# Altium schematic sheet PressureADC.SchDoc
size A4
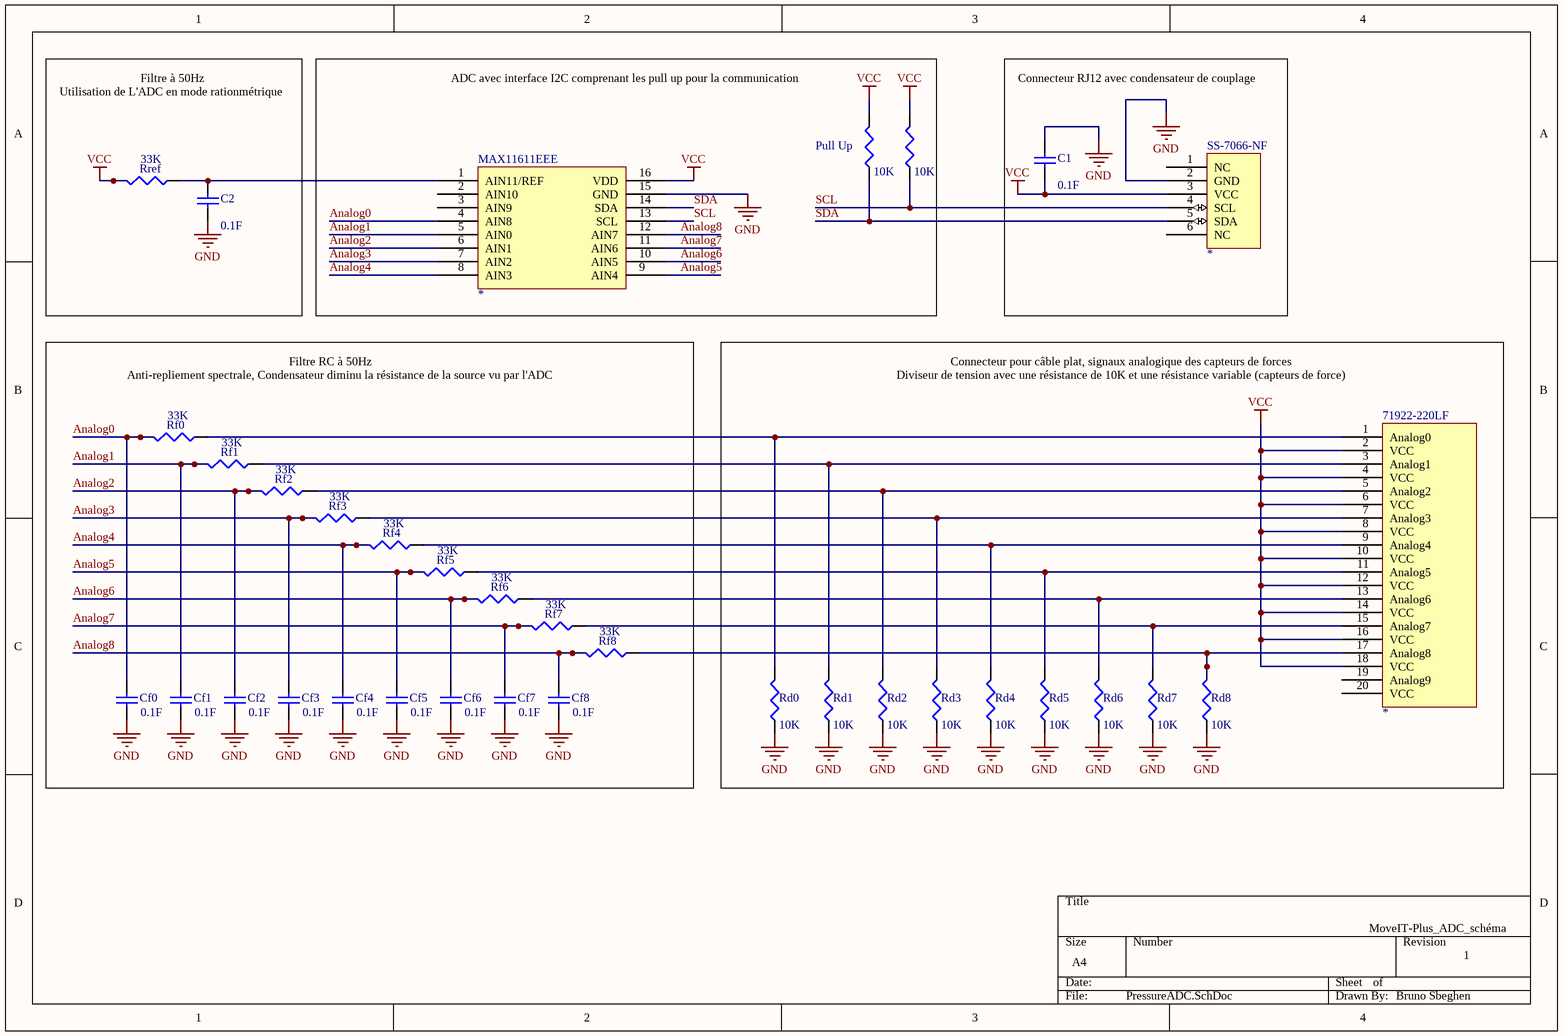
[diagram p0: PressureADC.SchDoc]

## Parts
71922-220LF  *  [71922-220LF]
?  value 10K  [6-0805_N]  (hidden comment: Res 10K)
C1  value 0.1F  [C0805]  (hidden comment: Cap 0.1uF)
C2  value 0.1F  [C0805]  (hidden comment: Cap 0.1uF)
Cf0  value 0.1F  [C0805]  (hidden comment: Cap 0.1uF)
Cf1  value 0.1F  [C0805]  (hidden comment: Cap 0.1uF)
Cf2  value 0.1F  [C0805]  (hidden comment: Cap 0.1uF)
Cf3  value 0.1F  [C0805]  (hidden comment: Cap 0.1uF)
Cf4  value 0.1F  [C0805]  (hidden comment: Cap 0.1uF)
Cf5  value 0.1F  [C0805]  (hidden comment: Cap 0.1uF)
Cf6  value 0.1F  [C0805]  (hidden comment: Cap 0.1uF)
Cf7  value 0.1F  [C0805]  (hidden comment: Cap 0.1uF)
Cf8  value 0.1F  [C0805]  (hidden comment: Cap 0.1uF)
MAX11611EEE  *  [MAX11611EEE+]
Pull_Up  value 10K  [6-0805_N]  (hidden comment: Res 10K)
Rd0  value 10K  [6-0805_N]  (hidden comment: Res 10K)
Rd1  value 10K  [6-0805_N]  (hidden comment: Res 10K)
Rd2  value 10K  [6-0805_N]  (hidden comment: Res 10K)
Rd3  value 10K  [6-0805_N]  (hidden comment: Res 10K)
Rd4  value 10K  [6-0805_N]  (hidden comment: Res 10K)
Rd5  value 10K  [6-0805_N]  (hidden comment: Res 10K)
Rd6  value 10K  [6-0805_N]  (hidden comment: Res 10K)
Rd7  value 10K  [6-0805_N]  (hidden comment: Res 10K)
Rd8  value 10K  [6-0805_N]  (hidden comment: Res 10K)
Rf0  value 33K  [6-0805_N]  (hidden comment: Res 33K)
Rf1  value 33K  [6-0805_N]  (hidden comment: Res 33K)
Rf2  value 33K  [6-0805_N]  (hidden comment: Res 33K)
Rf3  value 33K  [6-0805_N]  (hidden comment: Res 33K)
Rf4  value 33K  [6-0805_N]  (hidden comment: Res 33K)
Rf5  value 33K  [6-0805_N]  (hidden comment: Res 33K)
Rf6  value 33K  [6-0805_N]  (hidden comment: Res 33K)
Rf7  value 33K  [6-0805_N]  (hidden comment: Res 33K)
Rf8  value 33K  [6-0805_N]  (hidden comment: Res 33K)
Rref  value 33K  [6-0805_N]  (hidden comment: Res 33K)
SS-7066-NF  *  [SS-7066-NF]

## Blocks framed on the sheet
Connecteur RJ12 avec condensateur de couplage: C1 SS-7066-NF
Filtre RC à 50Hz: Cf0-Cf8 Rf0-Rf8

## Nets
GND: C1.2 C2.1 Cf0.2 Cf1.2 Cf2.2 Cf3.2 Cf4.2 Cf5.2 Cf6.2 Cf7.2 Cf8.2 MAX11611EEE.15(GND) Rd0.1 Rd1.1 Rd2.1 Rd3.1 Rd4.1 Rd5.1 Rd6.1 Rd7.1 Rd8.1 SS-7066-NF.2(GND)
VCC: 71922-220LF.2(VCC) 71922-220LF.4(VCC) 71922-220LF.6(VCC) 71922-220LF.8(VCC) 71922-220LF.10(VCC) 71922-220LF.12(VCC) 71922-220LF.14(VCC) 71922-220LF.16(VCC) 71922-220LF.18(VCC) ?.2 C1.1 MAX11611EEE.16(VDD) Pull_Up.2 Rref.2 SS-7066-NF.3(VCC)
Analog0: Cf0.1 MAX11611EEE.4(AIN8) Rf0.2
Analog1: Cf1.1 MAX11611EEE.5(AIN0) Rf1.2
Analog2: Cf2.1 MAX11611EEE.6(AIN1) Rf2.2
Analog3: Cf3.1 MAX11611EEE.7(AIN2) Rf3.2
Analog4: Cf4.1 MAX11611EEE.8(AIN3) Rf4.2
Analog5: Cf5.1 MAX11611EEE.9(AIN4) Rf5.2
Analog6: Cf6.1 MAX11611EEE.10(AIN5) Rf6.2
Analog7: Cf7.1 MAX11611EEE.11(AIN6) Rf7.2
Analog8: Cf8.1 MAX11611EEE.12(AIN7) Rf8.2
SCL: ?.1 MAX11611EEE.13(SCL) SS-7066-NF.4(SCL)
SDA: MAX11611EEE.14(SDA) Pull_Up.1 SS-7066-NF.5(SDA)
Net71922-220LF_1: 71922-220LF.1(Analog0) Rd0.2 Rf0.1
Net71922-220LF_3: 71922-220LF.3(Analog1) Rd1.2 Rf1.1
Net71922-220LF_5: 71922-220LF.5(Analog2) Rd2.2 Rf2.1
Net71922-220LF_7: 71922-220LF.7(Analog3) Rd3.2 Rf3.1
Net71922-220LF_9: 71922-220LF.9(Analog4) Rd4.2 Rf4.1
Net71922-220LF_11: 71922-220LF.11(Analog5) Rd5.2 Rf5.1
Net71922-220LF_13: 71922-220LF.13(Analog6) Rd6.2 Rf6.1
Net71922-220LF_15: 71922-220LF.15(Analog7) Rd7.2 Rf7.1
Net71922-220LF_17: 71922-220LF.17(Analog8) Rd8.2 Rf8.1
NetC2_2: C2.2 MAX11611EEE.1(AIN11/REF) Rref.1

Not connected (* = marked no-connect by the designer): 71922-220LF 19(Analog9) 20(VCC); MAX11611EEE 2(AIN10) 3(AIN9); SS-7066-NF 1(NC) 6(NC)

## Notes on the sheet
- Utilisation de L'ADC en mode rationmétrique
- Filtre à 50Hz
- (near Pull_Up) ADC avec interface I2C comprenant les pull up pour la communication
- Anti-repliement spectrale, Condensateur diminu la résistance de la source vu par l'ADC
- Diviseur de tension avec une résistance de 10K et une résistance variable (capteurs de force)
- Connecteur pour câble plat, signaux analogique des capteurs de forces
- MoveIT-Plus_ADC_schéma
- 1
- Bruno Sbeghen

## Library data of the parts
71922-220LF = 71922-220LF: Flat cable connector; Supplier 1: Digi-Key; Supplier Part Number 1: 609-3526-ND
? Pull_Up Rd0-Rd8 = Res 10K: Resistor 10K; Published: 8-Jun-2000; LatestRevisionDate: 29-May-2009; LatestRevisionNote: IPC-7351 Footprint Added.; PackageReference: J1-0603; Publisher: Altium Limited; PackageDescription: Chip Resistor; Supplier 1: Digi-Key; Supplier Part Number 1: 311-10.0KCRCT-ND
C1 C2 Cf0-Cf8 = Cap 0.1uF: Capacitor 0.1uF; Published: 8-Jun-2000; LatestRevisionDate: 29-May-2009; LatestRevisionNote: IPC-7351 Footprint Added.; PackageReference: C1206; Publisher: Altium Limited; PackageDescription: Chip Capacitor; Supplier 1: Digi-Key; Supplier Part Number 1: 478-1395-1-ND
MAX11611EEE = MAX11611EEE: ADC with I2C interface; Supplier 1: Digi-Key; Supplier Part Number 1: MAX11611EEE+-ND
Rf0-Rf8 Rref = Res 33K: Resistor 33K; Published: 8-Jun-2000; LatestRevisionDate: 29-May-2009; LatestRevisionNote: IPC-7351 Footprint Added.; PackageReference: J1-0603; Publisher: Altium Limited; PackageDescription: Chip Resistor; Supplier 1: Digi-Key; Supplier Part Number 1: 311-33.0KHRCT-ND
SS-7066-NF = SS-7066-NF: RJ12 Connector; Supplier 1: Digi-Key; Supplier Part Number 1: 380-1043-ND